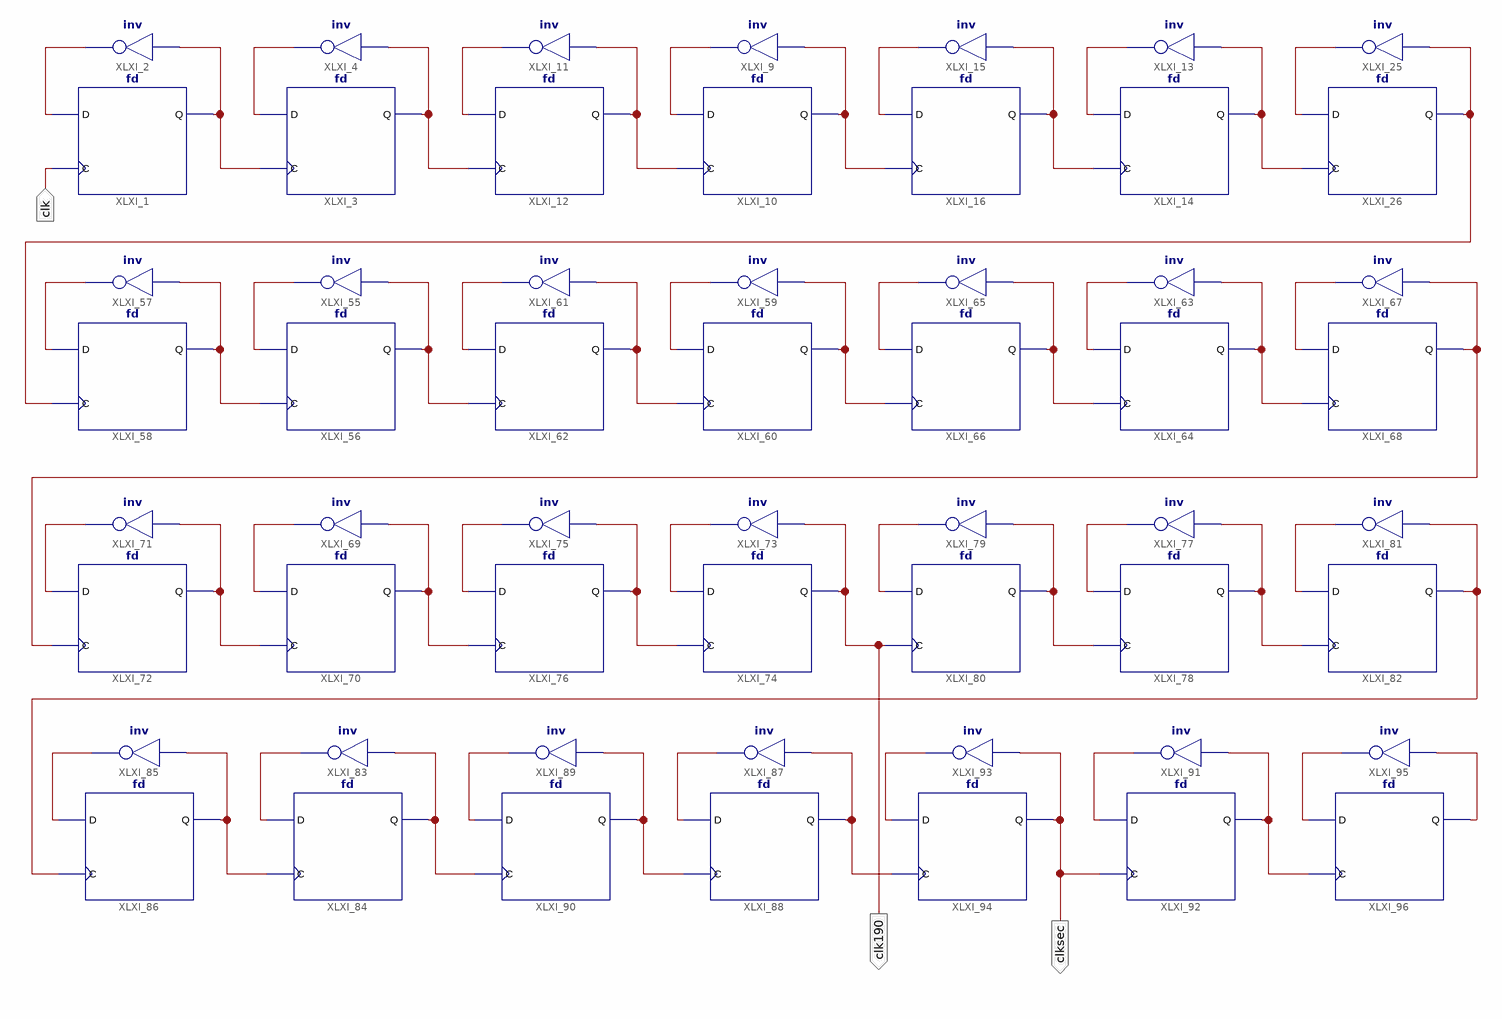
[diagram p0: schematic sheet 1]
// Xilinx ISE schematic clkdiv.sch (spartan3e) as structural Verilog: 56 symbols, 3 ports
module clkdiv (
  input  clk,
  output clksec,
  output clk190
);

  wire XLXN_1, XLXN_2, XLXN_3, XLXN_4, XLXN_12, XLXN_13, XLXN_14, XLXN_15, XLXN_16, XLXN_17, XLXN_18,
       XLXN_19, XLXN_28, XLXN_29, XLXN_61, XLXN_62, XLXN_63, XLXN_64, XLXN_65, XLXN_66, XLXN_67, XLXN_68,
       XLXN_69, XLXN_70, XLXN_71, XLXN_72, XLXN_73, XLXN_74, XLXN_75, XLXN_76, XLXN_77, XLXN_78, XLXN_80,
       XLXN_81, XLXN_82, XLXN_83, XLXN_84, XLXN_85, XLXN_86, XLXN_87, XLXN_88, XLXN_89, XLXN_90, XLXN_92,
       XLXN_93, XLXN_94, XLXN_95, XLXN_96, XLXN_97, XLXN_98, XLXN_100, XLXN_102, xxx, xyx;

  not XLXI_4 (XLXN_3, XLXN_4);
  fd XLXI_3 (.C(XLXN_2), .D(XLXN_3), .Q(XLXN_4));
  not XLXI_2 (XLXN_1, XLXN_2);
  fd XLXI_1 (.C(clk), .D(XLXN_1), .Q(XLXN_2));
  not XLXI_9 (XLXN_13, XLXN_12);
  fd XLXI_10 (.C(XLXN_14), .D(XLXN_13), .Q(XLXN_12));
  not XLXI_11 (XLXN_15, XLXN_14);
  fd XLXI_12 (.C(XLXN_4), .D(XLXN_15), .Q(XLXN_14));
  not XLXI_13 (XLXN_17, XLXN_16);
  fd XLXI_14 (.C(XLXN_18), .D(XLXN_17), .Q(XLXN_16));
  not XLXI_15 (XLXN_19, XLXN_18);
  fd XLXI_16 (.C(XLXN_12), .D(XLXN_19), .Q(XLXN_18));
  not XLXI_25 (XLXN_29, XLXN_28);
  fd XLXI_26 (.C(XLXN_16), .D(XLXN_29), .Q(XLXN_28));
  not XLXI_55 (XLXN_62, XLXN_61);
  fd XLXI_56 (.C(XLXN_63), .D(XLXN_62), .Q(XLXN_61));
  not XLXI_57 (XLXN_64, XLXN_63);
  fd XLXI_58 (.C(XLXN_28), .D(XLXN_64), .Q(XLXN_63));
  not XLXI_59 (XLXN_66, XLXN_65);
  fd XLXI_60 (.C(XLXN_67), .D(XLXN_66), .Q(XLXN_65));
  not XLXI_61 (XLXN_68, XLXN_67);
  fd XLXI_62 (.C(XLXN_61), .D(XLXN_68), .Q(XLXN_67));
  not XLXI_63 (XLXN_70, XLXN_69);
  fd XLXI_64 (.C(XLXN_71), .D(XLXN_70), .Q(XLXN_69));
  not XLXI_65 (XLXN_72, XLXN_71);
  fd XLXI_66 (.C(XLXN_65), .D(XLXN_72), .Q(XLXN_71));
  not XLXI_67 (XLXN_74, XLXN_73);
  fd XLXI_68 (.C(XLXN_69), .D(XLXN_74), .Q(XLXN_73));
  not XLXI_83 (XLXN_90, XLXN_89);
  fd XLXI_84 (.C(xyx), .D(XLXN_90), .Q(XLXN_89));
  not XLXI_85 (XLXN_92, xyx);
  fd XLXI_86 (.C(XLXN_87), .D(XLXN_92), .Q(xyx));
  not XLXI_87 (XLXN_94, XLXN_93);
  fd XLXI_88 (.C(XLXN_95), .D(XLXN_94), .Q(XLXN_93));
  not XLXI_89 (XLXN_96, XLXN_95);
  fd XLXI_90 (.C(XLXN_89), .D(XLXN_96), .Q(XLXN_95));
  not XLXI_91 (XLXN_98, XLXN_97);
  fd XLXI_92 (.C(clksec), .D(XLXN_98), .Q(XLXN_97));
  not XLXI_93 (XLXN_100, clksec);
  fd XLXI_94 (.C(XLXN_93), .D(XLXN_100), .Q(clksec));
  not XLXI_95 (XLXN_102, xxx);
  fd XLXI_96 (.C(XLXN_97), .D(XLXN_102), .Q(xxx));
  not XLXI_69 (XLXN_76, XLXN_75);
  fd XLXI_70 (.C(XLXN_77), .D(XLXN_76), .Q(XLXN_75));
  not XLXI_71 (XLXN_78, XLXN_77);
  fd XLXI_72 (.C(XLXN_73), .D(XLXN_78), .Q(XLXN_77));
  not XLXI_73 (XLXN_80, clk190);
  fd XLXI_74 (.C(XLXN_81), .D(XLXN_80), .Q(clk190));
  not XLXI_75 (XLXN_82, XLXN_81);
  fd XLXI_76 (.C(XLXN_75), .D(XLXN_82), .Q(XLXN_81));
  not XLXI_77 (XLXN_84, XLXN_83);
  fd XLXI_78 (.C(XLXN_85), .D(XLXN_84), .Q(XLXN_83));
  not XLXI_79 (XLXN_86, XLXN_85);
  fd XLXI_80 (.C(clk190), .D(XLXN_86), .Q(XLXN_85));
  not XLXI_81 (XLXN_88, XLXN_87);
  fd XLXI_82 (.C(XLXN_83), .D(XLXN_88), .Q(XLXN_87));
endmodule
